# Altium schematic sheet as14120_fpga.SchDoc
size A3; PageSetup: Record=PageOptions|CenterHorizontal=True|CenterVertical=True|PrintScale=1.00|XCorrection=1.00|YCorrection=1.00|PrintKind=1|BorderSize=5000000|LeftOffset=0|BottomOffset=0|Orientation=2|PaperLength=1000|PaperWidth=1000|Scale=100|PaperSource=7|PrintQuality=-4|MediaType=1|DitherType=10|PaperKind=A4 (210 x 297 мм)|PrintScaleMode=1
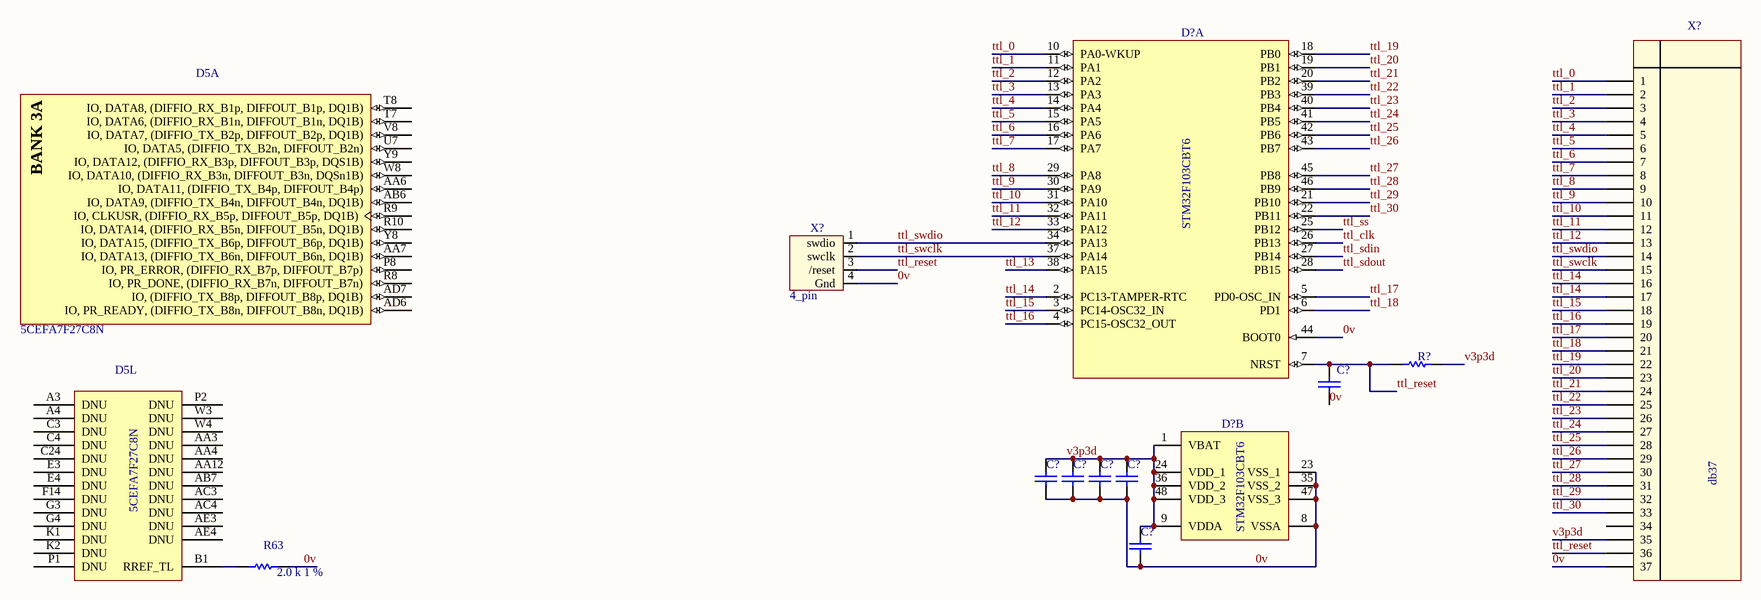
[diagram p0: as14120_fpga.SchDoc]

## Parts
(Parts that share a designator on the sheet are numbered #1, #2 ... from top to bottom, then left to right.)
C?#1  CAP 1uF 10V 0402(1005)  [CAPC0402(1005)60_M]  (value not drawn)
C?#2  CAP 1uF 10V 0402(1005)  [CAPC0402(1005)60_M]  (value not drawn)
C?#3  CAP 1uF 10V 0402(1005)  [CAPC0402(1005)60_M]  (value not drawn)
C?#4  CAP 1uF 10V 0402(1005)  [CAPC0402(1005)60_M]  (value not drawn)
C?#5  CAP 1uF 10V 0402(1005)  [CAPC0402(1005)60_M]  (value not drawn)
C?#6  CAP 1uF 10V 0402(1005)  [CAPC0402(1005)60_M]  (value not drawn)
D5  5CEFA7F27C8N  [ALTR-672-FBGA-2000A]  (parts A,L of 12)
D?#1  STM32F103CBT6  [LQFP48_N]  (part A of 2)
D?#2  STM32F103CBT6  [LQFP48_N]  (part B of 2)
R63  value 2.0 k  Tolerance: 1 %  [RESC0805(2012)_L]  (hidden comment: 1K 1% 0805(2012))
R?  1K 1% 0805(2012)  [RESC0805(2012)_L]  (value not drawn)
X?#1  db37  [DSUB1.385-2H25A]
X?#2  4_pin  [4_pin]

## Nets
0v: C?#1.1 C?#2.1 C?#3.1 C?#4.1 C?#5.1 C?#6.1 D?#1.44(BOOT0) D?#2.8(VSSA) D?#2.23(VSS_1) D?#2.35(VSS_2) D?#2.47(VSS_3) R63.2 X?#1.37 X?#2.4(Gnd)
ttl_0: D?#1.10(PA0-WKUP) X?#1.1
ttl_1: D?#1.11(PA1) X?#1.2
ttl_2: D?#1.12(PA2) X?#1.3
ttl_3: D?#1.13(PA3) X?#1.4
ttl_4: D?#1.14(PA4) X?#1.5
ttl_5: D?#1.15(PA5) X?#1.6
ttl_6: D?#1.16(PA6) X?#1.7
ttl_7: D?#1.17(PA7) X?#1.8
ttl_8: D?#1.29(PA8) X?#1.9
ttl_9: D?#1.30(PA9) X?#1.10
ttl_10: D?#1.31(PA10) X?#1.11
ttl_11: D?#1.32(PA11) X?#1.12
ttl_12: D?#1.33(PA12) X?#1.13
ttl_13: D?#1.38(PA15)
ttl_14: D?#1.2(PC13-TAMPER-RTC) X?#1.16 X?#1.17
ttl_15: D?#1.3(PC14-OSC32_IN) X?#1.18
ttl_16: D?#1.4(PC15-OSC32_OUT) X?#1.19
ttl_17: D?#1.5(PD0-OSC_IN) X?#1.20
ttl_18: D?#1.6(PD1) X?#1.21
ttl_19: D?#1.18(PB0) X?#1.22
ttl_20: D?#1.19(PB1) X?#1.23
ttl_21: D?#1.20(PB2) X?#1.24
ttl_22: D?#1.39(PB3) X?#1.25
ttl_23: D?#1.40(PB4) X?#1.26
ttl_24: D?#1.41(PB5) X?#1.27
ttl_25: D?#1.42(PB6) X?#1.28
ttl_26: D?#1.43(PB7) X?#1.29
ttl_27: D?#1.45(PB8) X?#1.30
ttl_28: D?#1.46(PB9) X?#1.31
ttl_29: D?#1.21(PB10) X?#1.32
ttl_30: D?#1.22(PB11) X?#1.33
ttl_clk: D?#1.26(PB13)
ttl_reset: C?#1.2 D?#1.7(NRST) R?.1 X?#1.36 X?#2.3(/reset)
ttl_sdin: D?#1.27(PB14)
ttl_sdout: D?#1.28(PB15)
ttl_ss: D?#1.25(PB12)
ttl_swclk: D?#1.37(PA14) X?#1.15 X?#2.2(swclk)
ttl_swdio: D?#1.34(PA13) X?#1.14 X?#2.1(swdio)
v3p3d: C?#2.2 C?#3.2 C?#4.2 C?#5.2 C?#6.2 D?#2.1(VBAT) D?#2.9(VDDA) D?#2.24(VDD_1) D?#2.36(VDD_2) D?#2.48(VDD_3) R?.2 X?#1.35
NetD5_B1: D5.B1(RREF_TL) R63.1

Not connected (* = marked no-connect by the designer): D5 A3(DNU) A4(DNU) AA3(DNU) AA4(DNU) AA6(IO,_DATA11,_(DIFFIO_TX_B4p,_DIFFOUT_B4p)) AA7(IO,_DATA13,_(DIFFIO_TX_B6n,_DIFFOUT_B6n,_DQ1B)) AA12(DNU) AB6(IO,_DATA9,_(DIFFIO_TX_B4n,_DIFFOUT_B4n,_DQ1B)) AB7(DNU) AC3(DNU) AC4(DNU) AD6(IO,_PR_READY,_(DIFFIO_TX_B8n,_DIFFOUT_B8n,_DQ1B)) AD7(IO,_(DIFFIO_TX_B8p,_DIFFOUT_B8p,_DQ1B)) AE3(DNU) AE4(DNU) C3(DNU) C4(DNU) C24(DNU) E3(DNU) E4(DNU) F14(DNU) G3(DNU) G4(DNU) K1(DNU) K2(DNU) P1(DNU) P2(DNU) P8(IO,_PR_ERROR,_(DIFFIO_RX_B7p,_DIFFOUT_B7p)) R8(IO,_PR_DONE,_(DIFFIO_RX_B7n,_DIFFOUT_B7n)) R9(IO,_CLKUSR,_(DIFFIO_RX_B5p,_DIFFOUT_B5p,_DQ1B)) R10(IO,_DATA14,_(DIFFIO_RX_B5n,_DIFFOUT_B5n,_DQ1B)) T7(IO,_DATA6,_(DIFFIO_RX_B1n,_DIFFOUT_B1n,_DQ1B)) T8(IO,_DATA8,_(DIFFIO_RX_B1p,_DIFFOUT_B1p,_DQ1B)) U7(IO,_DATA5,_(DIFFIO_TX_B2n,_DIFFOUT_B2n)) V8(IO,_DATA7,_(DIFFIO_TX_B2p,_DIFFOUT_B2p,_DQ1B)) W3(DNU) W4(DNU) W8(IO,_DATA10,_(DIFFIO_RX_B3n,_DIFFOUT_B3n,_DQSn1B)) Y8(IO,_DATA15,_(DIFFIO_TX_B6p,_DIFFOUT_B6p,_DQ1B)) Y9(IO,_DATA12,_(DIFFIO_RX_B3p,_DIFFOUT_B3p,_DQS1B)); X?#1 34 38 39

## Notes on the sheet
- Title
- Size:
- Date:
- A3
- Number:
- Time:
- Revision:
- Sheet
- of
- File:
- (in symbol 5CEFA7F27C8N, part A) BANK 3A

## Library data of the parts
C?#1-C?#6 = CAP_0402: CAP 1uF 10V ±20% 0402 (1005 Metric) Thickness 0.6mm SMD; Case-Metric: 1005; Case-EIA: 0402; Value: 0.1; Tolerance: ±20%; Max Thickness: 0.6 mm; Rated Voltage: 10 V; Technology: SMT
D5 = 5CEFA7F27C8N: Cyclone V E Family FPGA, 1.07 to 1.13 V Supply, 336 I/O Pins, 7 PLLs, 672-Pin FBGA, Speed Grade 8, Commercial Grade, RoHS Compliant; Manufacturer: Altera; Device Group: 5CEFA7; GPIO: 336; Logic Elements (LE) (K): 149.5; Speed Grade: 8; DatasheetVersion: Rev. 3.1; PackageReference: 672-FBGA-2000A; PackageDescription: 672-Pin FineLine Ball-Grid Array (FBGA), Body 27 x 27 mm, Pitch 1 mm; Supplier 1: Digi-Key; Supplier Part Number 1: 5CEFA7F27C8N-ND; Supplier 2: Mouser; Supplier Part Number 2: 989-5CEFA7F27C8N; RoHS: RoHS Compliant; Subcategory: Cyclone V E; Voltage Supply: 1.07 to 1.13 V; Mounting Technology: Surface Mount; Code_JEDEC: MS-034-AAL-1; PartNumber: 5CEFA7F27C8N; ComponentLink1Description: Manufacturer URL; ComponentLink1URL: http://www.altera.com; ComponentLink2Description: Datasheet; ComponentLink2URL: http://www.altera.com/literature/hb/cyclone-v/cv_51002.pdf; ComponentLink3Description: Package Specification; ComponentLink3URL: http://www.altera.com/devicepackaging/04R00427-01.pdf; ComponentLink4Description: Device Handbook URL; ComponentLink4URL: http://www.altera.com/literature/hb/cyclone-v/cyclone5_handbook.pdf; ComponentLink5Description: Device Overview URL; ComponentLink5URL: http://www.altera.com/literature/hb/cyclone-v/cv_51001.pdf; ComponentLink6Description: Device Pin-Out URL; ComponentLink6URL: http://www.altera.com/literature/dp/cyclone-v/1.1.txt; ComponentLink7Description: Product URL; ComponentLink7URL: http://www.buyaltera.com/scripts/partsearch.dll?Detail&name=5CEFA7F27C8N-ND
D?#1 D?#2 = STM32F103CBT6: STM32 ARM-based 32-bit MCU Performance Line with 128 kB Flash, 20 kB Internal RAM, -40 to +85°C Temperature, 48-Pin LQFP, Tray; DatasheetVersion: rev13.0, Apr-2011; PackageVersion: rev13, Apr-2011; PackageReference: LQFP48; PackageDescription: 48-Pin Low-Profile Quad Flat Pack, 7 x 7 mm Body, 0.5 mm Pitch (LQFP48); ComponentLink1Description: Manufacturer URL; ComponentLink1URL: http://www.st.com/; ComponentLink2Description: STM32F103 Datasheet; ComponentLink2URL: http://www.st.com/internet/com/TECHNICAL_RESOURCES/TECHNICAL_LITERATURE/DATASHEET/CD00161566.pdf; ComponentLink3Description: STM32 Family Web Page; ComponentLink3URL: www.st.com/stm32
R63 = RES_0805: 1K 0.125W 1% 0805 (2012 Metric)  SMD; Case-Metric: 2012; Case-EIA: 0805; Power: 0.125 W; Technology: SMT
R? = RES_0805: 1K 0.125W 1% 0805 (2012 Metric)  SMD; Case-Metric: 2012; Value: 51 k; Case-EIA: 0805; Tolerance: 1 %; Power: 0.125 W; Technology: SMT